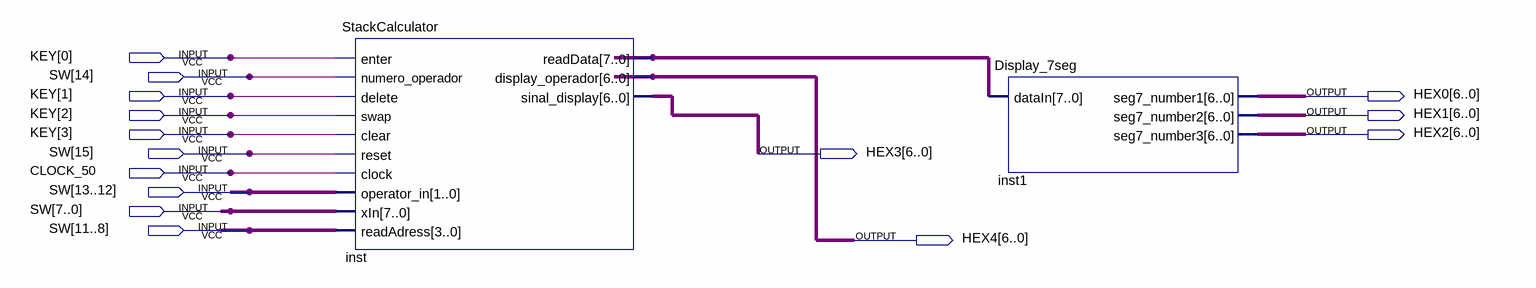
[diagram p0: schematic sheet]
// Quartus schematic StackCalculator_bdf.bdf as structural Verilog: 2 symbols, 15 pins
module StackCalculator_bdf (
  input  [3:0] KEY,
  input  [15:0] SW,
  input  CLOCK_50,
  output [6:0] HEX0,
  output [6:0] HEX1,
  output [6:0] HEX2,
  output [6:0] HEX3,
  output [6:0] HEX4
);

  wire [7:0] inst_readdata;

  StackCalculator inst (
    .enter(KEY[0]), .numero_operador(SW[14]), .delete(KEY[1]), .swap(KEY[2]), .clear(KEY[3]), .reset(SW[15]),
    .clock(CLOCK_50), .operator_in(SW[13:12]), .xIn(SW[7:0]), .readAdress(SW[11:8]),
    .readData(inst_readdata), .display_operador(HEX4), .sinal_display(HEX3));
  Display_7seg inst1 (.dataIn(inst_readdata), .seg7_number1(HEX0), .seg7_number2(HEX1), .seg7_number3(HEX2));
endmodule
